# EAGLE design MJ828 - prod - FPC (EAGLE 9.4.0)
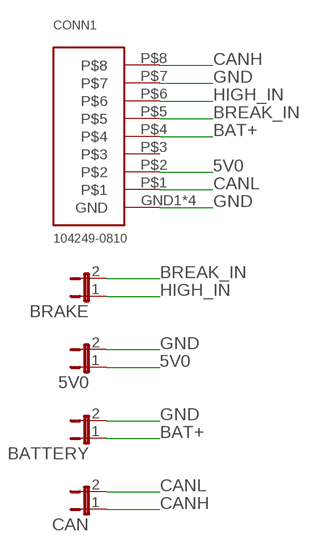
[diagram p0: schematic, sheet 1]

## Parts
5V0  JP1E  [JP1]
BATTERY  JP1E  [JP1]
BRAKE  JP1E  [JP1]
CAN  JP1E  [JP1]
CONN1  104249-0810  104259-0810  [SMD]

## Nets
5V0 [5v0]: 5V0.1 CONN1.P$2
BAT+ [Bat+]: BATTERY.1 CONN1.P$4
BREAK_IN [signal]: BRAKE.2 CONN1.P$5
CANH [signal]: CAN.1 CONN1.P$8
CANL [signal]: CAN.2 CONN1.P$1
GND: 5V0.2 BATTERY.2 CONN1.GND1(GND) CONN1.GND2(GND) CONN1.GND3(GND) CONN1.GND4(GND) CONN1.P$7
HIGH_IN [signal]: BRAKE.1 CONN1.P$6
Unconnected: CONN1.P$3

## Library data of the parts
5V0 BATTERY BRAKE CAN = jumper:JP1E: JUMPER
CONN1 = 1042490810 - Board to Board Connector, 8p - Receptable:104259-0810

## Net classes
0 GND: width 0.254 mm, drill 0.254 mm, clearance 0.127 mm
1 Bat+: width 0.5 mm, drill 0.35 mm, clearance 0.2 mm
2 5v0: width 0.3 mm, drill 0.35 mm, clearance 0.2 mm
3 signal: width 0.25 mm, drill 0.35 mm, clearance 0.2 mm

## Board
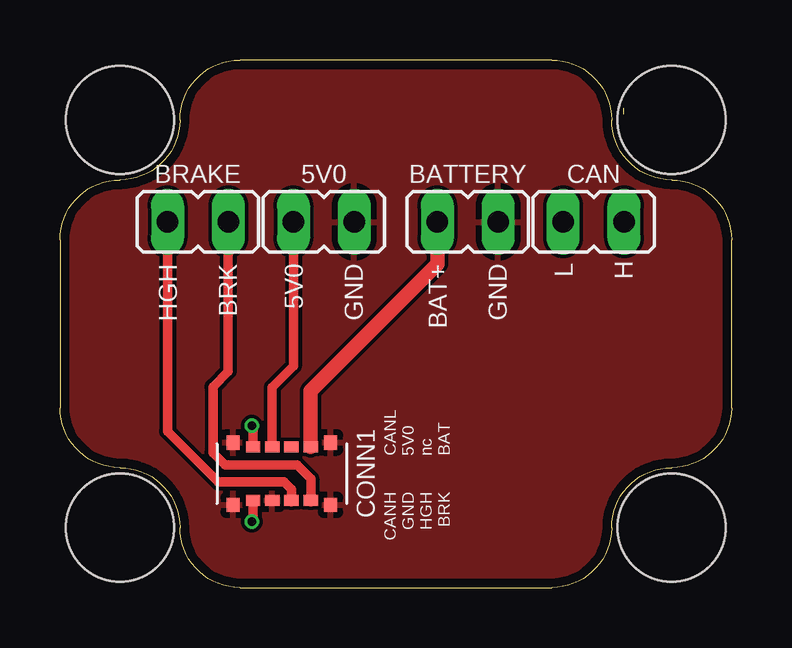
[diagram p1: board, top side]
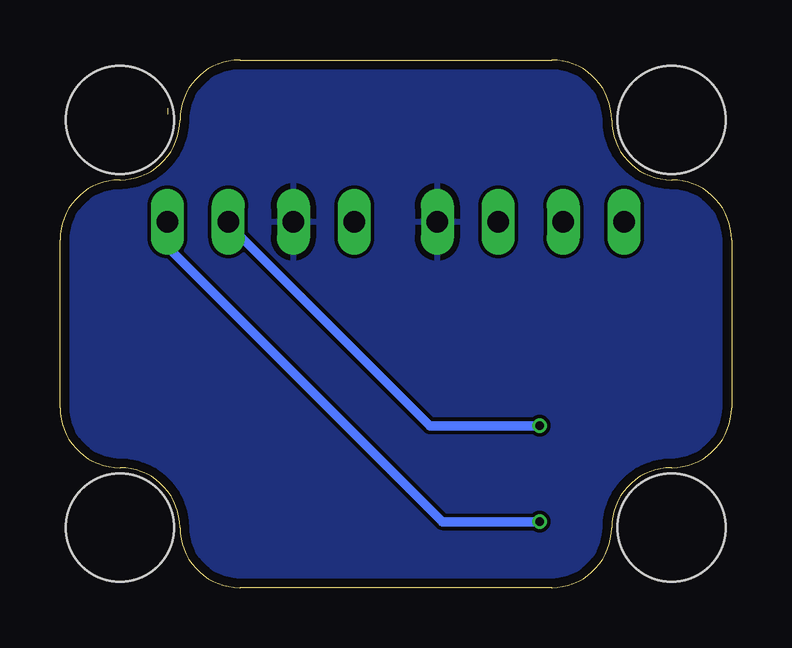
[diagram p2: board, bottom side, seen from below]

Size 28 x 22 mm. Coordinates in mm from the lower left corner, seen from the top.
Outline: 23.5,19.75 23.5,20
Outline: 7.5,0 20.5,0 arc90 23,2.5 arc-90 25.5,5 arc90 28,7.5 28,14.5 arc90 25.5,17 arc-90 23,19.5 arc90 20.5,22 7.5,22 arc90 5,19.5 arc-90 2.5,17 arc90 0,14.5 0,7.5 arc90 2.5,5 arc-90 5,2.5 arc90 7.5,0
Copper layers (1*16): Top 0.035559375mm / dielectric 1.6mm / Bottom 0.035559375mm
Design rules "oshpark-2layer": minimum track width 6mil, minimum drill 10mil, track to track 6mil, track to pad 6mil, pad to pad 6mil, via to via 6mil, smd to smd 6mil, copper to edge 15mil, drill to drill 6mil, minimum pad ring 5mil, minimum via ring 5mil, stop-mask expansion 2.5mil, vias tented up to drill 0mil, thermal gap 10mil
Holes 4.5 mm at 2.5,19.5 25.5,19.5 25.5,2.5 2.5,2.5

### Footprints (pad centres in the part's own frame; a part is rotated, then mirrored left to right if it is on the bottom)
JP1 = drill 0.914 long: 1 0,-1.27; 2 0,1.27
SMD = smd 0.55 x 0.6: GND1 -2.03,1.3; GND2 2.03,1.3; GND3 -2.03,-1.3; GND4 2.03,-1.3 | smd 0.6 x 0.45: P$1 -1.2,1.12; P$2 -0.4,1.12; P$3 0.4,1.12; P$4 1.2,1.12; P$5 1.2,-1.12; P$6 0.4,-1.12; P$7 -0.4,-1.12; P$8 -1.2,-1.12

### Placement (x,y rotation side)
5V0  11,15.25 270 top
BATTERY  17,15.25 270 top
BRAKE  5.75,15.25 270 top
CAN  22.25,15.25 90 top
CONN1  9.25,4.75 0 top

### Tracks (layer width: path | path; a pad name or v marks a point on that pad's centre or on a via)
5V0
  Top 0.4: 5V0.1 9.73,9.23 8.85,8.35 CONN1.P$2
BAT+
  Top 0.6: BATTERY.1 15.73,13.48 10.45,8.2 CONN1.P$4
BREAK_IN
  Top 0.4: 10.46,3.64 10.46,4.54 9.88,5.12 6.88,5.12 6.38,5.62 6.38,8.38 7.02,9.02 BRAKE.2
  Top 0.5: CONN1.P$5 10.46,3.64
CANH  (via drill 0.35)
  Top 0.4: CONN1.P$8 8.05,2.8 v8,2.75
  Bottom 0.4: v8,2.75 12.06,2.75 23.52,14.21 CAN.1
  Bottom 0.5: v8,2.75
CANL  (via drill 0.35)
  Top 0.4: CONN1.P$1 8.05,6.7 v8,6.75
  Bottom 0.4: v8,6.75 12.57,6.75 20.98,15.16 CAN.2
GND
  pour Top: 0,22 28,22 28,0 0,0
  pour Bottom: 0,22 28,22 28,0 0,0
HIGH_IN
  Top 0.4: BRAKE.1 4.48,6.52 6.6,4.4 9.35,4.4 9.66,4.09 9.66,3.64
  Top 0.5: CONN1.P$6 9.66,3.64

### Text on the board
tPlace: HGH | BRK | 5V0 | GND | BAT+ | GND | L | H | CANL | 5V0 | nc | BAT | CANH | GND | HGH | BRK
tStop: MJ-828 FPC / ejovrh v.1